# Altium schematic sheet BM833.SchDoc
size A4
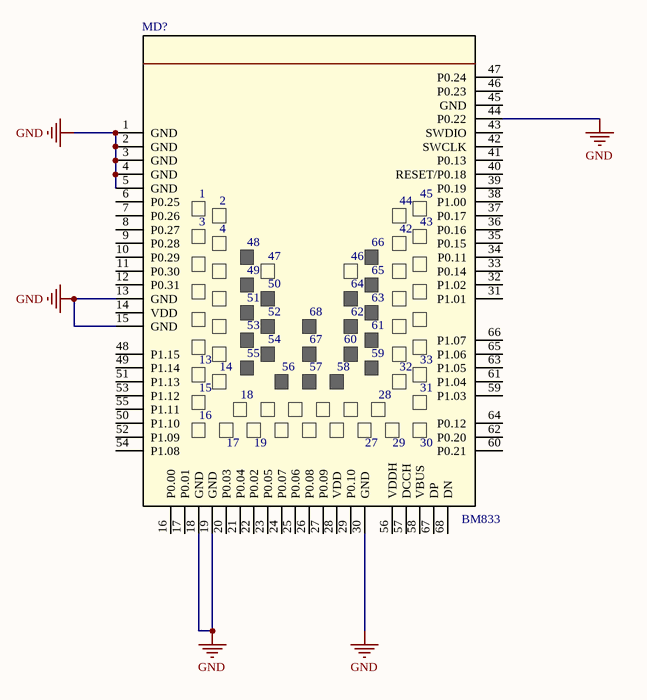
[diagram p0: BM833.SchDoc]

## Parts
MD?  BM833  [BM833]

## Nets
GND: MD?.1(GND) MD?.2(GND) MD?.3(GND) MD?.4(GND) MD?.5(GND) MD?.13(GND) MD?.15(GND) MD?.18(GND) MD?.19(GND) MD?.30(GND) MD?.44(P0.22)

Not connected (* = marked no-connect by the designer): MD? 6(P0.25) 7(P0.26) 8(P0.27) 9(P0.28) 10(P0.29) 11(P0.30) 12(P0.31) 14(VDD) 16(P0.00) 17(P0.01) 20(P0.03) 21(P0.04) 22(P0.02) 23(P0.05) 24(P0.07) 25(P0.06) 26(P0.08) 27(P0.09) 28(VDD) 29(P0.10) 31(P1.01) 32(P1.02) 33(P0.14) 34(P0.11) 35(P0.15) 36(P0.16) 37(P0.17) 38(P1.00) 39(P0.19) 40(RESET/P0.18) 41(P0.13) 42(SWCLK) 43(SWDIO) 45(GND) 46(P0.23) 47(P0.24) 48(P1.15) 49(P1.14) 50(P1.10) 51(P1.13) 52(P1.09) 53(P1.12) 54(P1.08) 55(P1.11) 56(VDDH) 57(DCCH) 58(VBUS) 59(P1.03) 60(P0.21) 61(P1.04) 62(P0.20) 63(P1.05) 64(P0.12) 65(P1.06) 66(P1.07) 67(DP) 68(DN)

## Library data of the parts
MD? = BM833: ultra low power Bluetooth Low Energy (BLE) modules using Nordic nRF52 SoC.  PCB trace Antenna; Manufacturer: Fanstel; PartNumber: BM833